# EAGLE design RTC_Card (EAGLE 7.6.0)

## Sheet 1 of 2
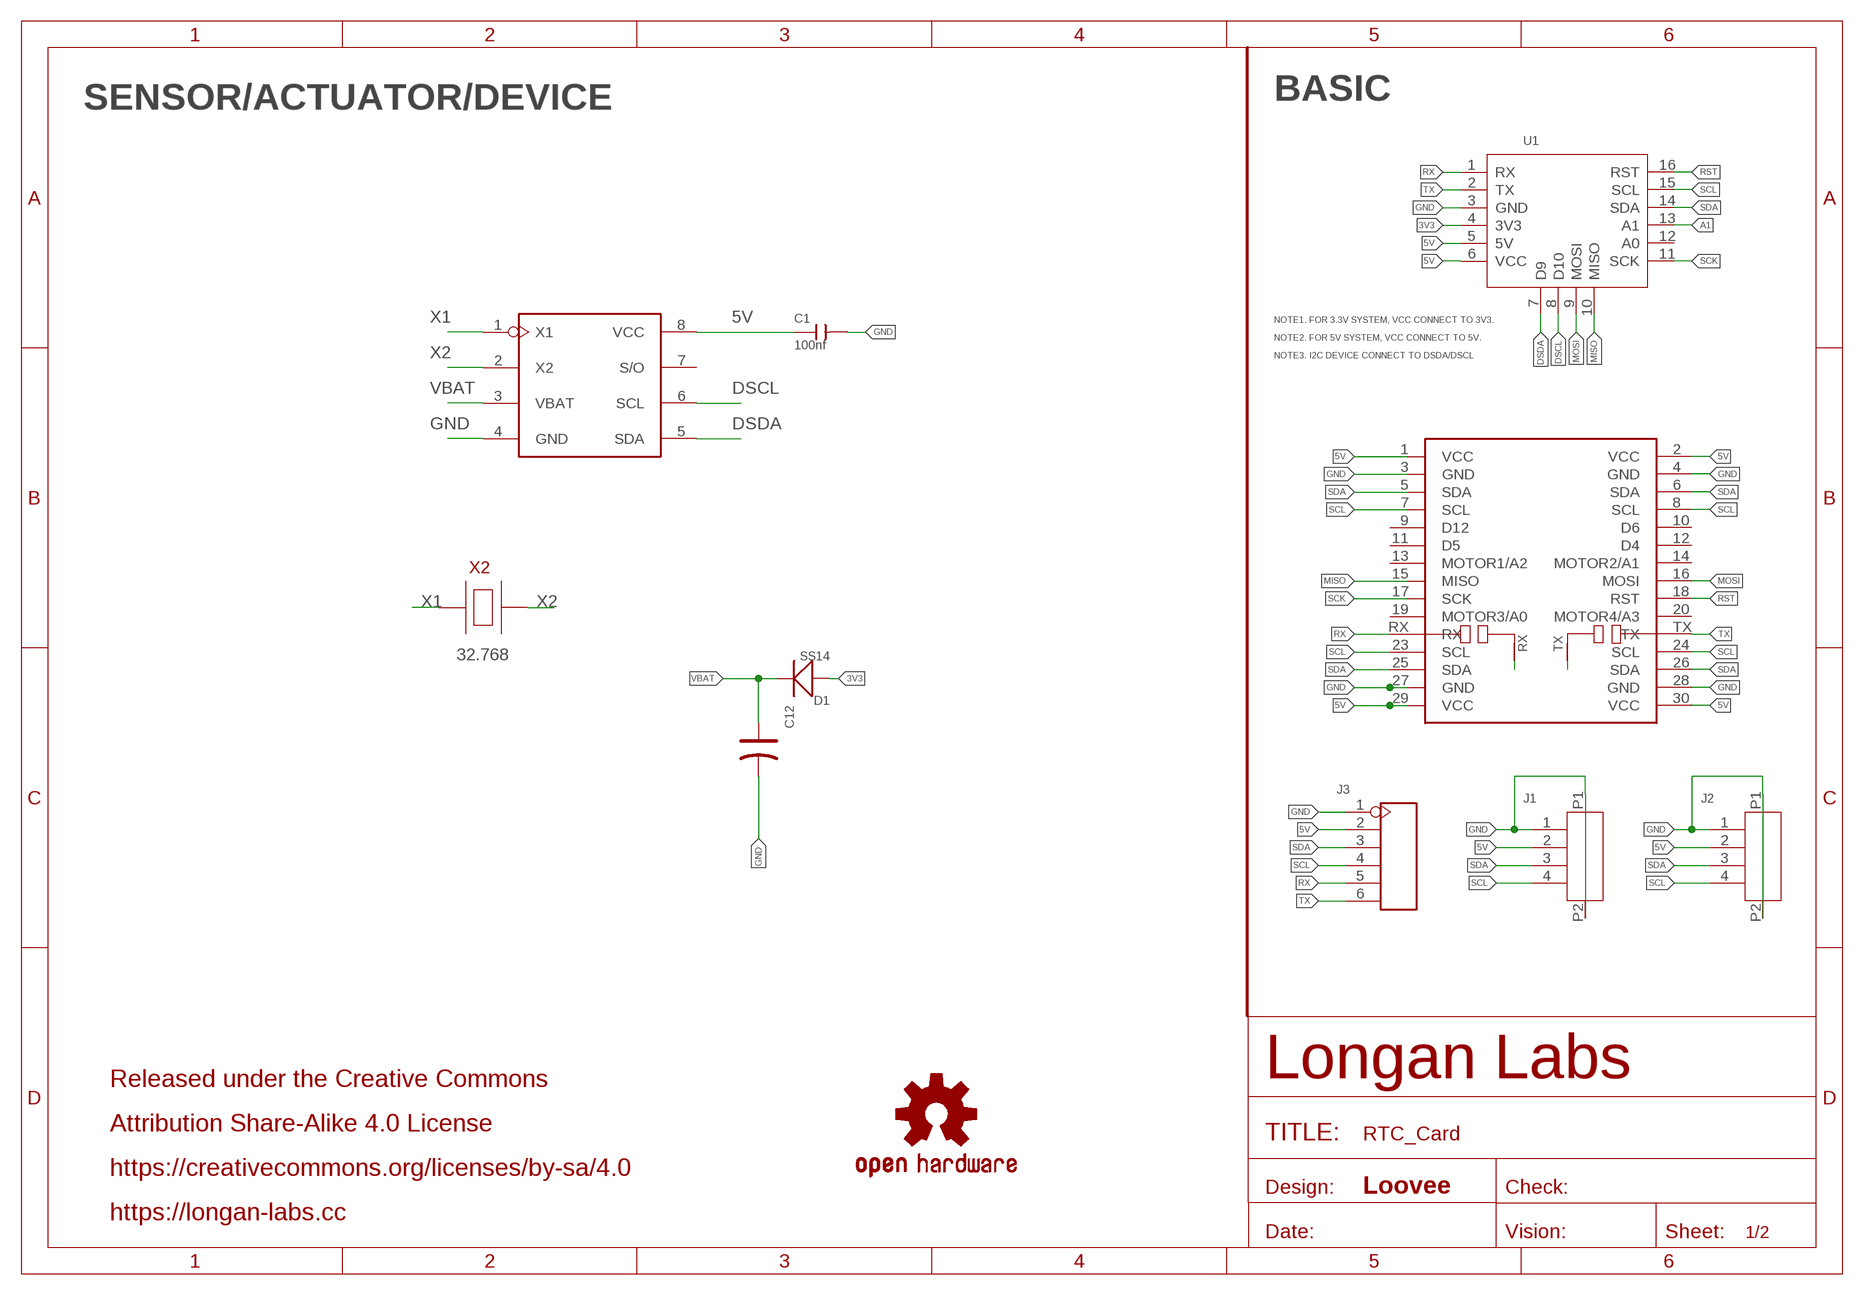
[diagram p0: schematic, sheet 1]

### Parts
C1  100nf  CAP-0603  [C0603]
C12  CAP-POLAR-CS-ME-414TA  [SC-2P-D4.8MM]
D1  SS14  DIODE'SMA'  [DO-214AC]
J1  HEADER-4P-1.0  [4P-1.0-90D]
J2  HEADER-4P-1.0  [4P-1.0-90D]
J3  HEADER-6P-55/35MIL  [H6-2.54]
LOGO2  OSHW-LOGOS  [OSHW-LOGO-S]
MOUDLE2  MOUDLE-CARDS-UART'BOARD'  [MOUDLE-2X15P-UART]
U1  MOUDLE-CARDS  [16P-2.0-CARDS]
U2  DS1307  [SO08]
X2  32768  CRYSTAL-2P  [2P-3215]

### Nets
3V3: D1.1(+) U1.4(3V3)
5V: C1.1 J1.2 J2.2 J3.2 MOUDLE2.1(VCC) MOUDLE2.2(VCC) MOUDLE2.29(VCC) MOUDLE2.30(VCC) U1.5(5V) U1.6(VCC) U2.8(VCC)
A1: U1.13(A1)
DSCL: U1.8(D10) U2.6(SCL)
DSDA: U1.7(D9) U2.5(SDA)
GND: C1.2 C12.2(-) J1.1 J1.P1 J1.P2 J2.1 J2.P1 J2.P2 J3.1 MOUDLE2.3(GND) MOUDLE2.4(GND) MOUDLE2.27(GND) MOUDLE2.28(GND) U1.3(GND) U2.4(GND)
MISO: MOUDLE2.15(MISO) U1.10(MISO)
MOSI: MOUDLE2.16(MOSI) U1.9(MOSI)
N$1: MOUDLE2.RX/N1(RX/N) MOUDLE2.RX/N2(RX/N)
N$2: MOUDLE2.TX/N1(TX/N) MOUDLE2.TX/N2(TX/N)
RST: MOUDLE2.18(RST) U1.16(RST)
RX: J3.5 MOUDLE2.RX U1.1(RX)
SCK: MOUDLE2.17(SCK) U1.11(SCK)
SCL: J1.4 J2.4 J3.4 MOUDLE2.7(SCL) MOUDLE2.8(SCL) MOUDLE2.23(SCL) MOUDLE2.24(SCL) U1.15(SCL)
SDA: J1.3 J2.3 J3.3 MOUDLE2.5(SDA) MOUDLE2.6(SDA) MOUDLE2.25(SDA) MOUDLE2.26(SDA) U1.14(SDA)
TX: J3.6 MOUDLE2.TX U1.2(TX)
VBAT: C12.1(+) D1.2(-) U2.3(VBAT)
X1: U2.1(X1) X2.X1
X2: U2.2(X2) X2.X2
Unconnected: MOUDLE2.9(D12) MOUDLE2.10(D6) MOUDLE2.11(D5) MOUDLE2.12(D4) MOUDLE2.13(MOTOR1/A2) MOUDLE2.14(MOTOR2/A1) MOUDLE2.19(MOTOR3/A0) MOUDLE2.20(MOTOR4/A3) U1.12(A0) U2.7(S/O)

### Notes on the sheet
- SENSOR/ACTUATOR/DEVICE | BASIC
- NOTE1. FOR 3.3V SYSTEM, VCC CONNECT TO 3V3.
- NOTE2. FOR 5V SYSTEM, VCC CONNECT TO 5V.
- NOTE3. I2C DEVICE CONNECT TO DSDA/DSCL
- 32.768
- Released under the Creative Commons
- Attribution Share-Alike 4.0 License
- https://creativecommons.org/licenses/by-sa/4.0
- Loovee
- https://longan-labs.cc

## Sheet 2 of 2

## Library data of the parts
C1 = Discrete-new:CAP: Ceramic Capacitors
C12 = Discrete-new:CAP-POLAR: Electrolytic Capacitors,Tantalum Capacitors and Super Capacitors
D1 = Discrete-new:DIODE*
J1 J2 = Longan-Connect:HEADER-4P-1.0
J3 = Connector-new:HEADER-6P
LOGO2 = SparkFun-Aesthetics:OSHW-LOGO: Open-Source Hardware (OSHW) Logo This logo indicates the piece of hardware it is found on incorporates a OSHW license and/or adheres to the definition of open source hardware found here: http://freedomdefined.org/OSHW
MOUDLE2 = Longan-moudle:MOUDLE-CARDS-UART
U1 = MOUDLE-CARDS:MOUDLE-CARDS
U2 = Seeed:DS1307
X2 = LONGAN-DISCRETE:CRYSTAL-2P

## Net classes
0 default: width 0.152 mm, clearance 0.152 mm

## Board
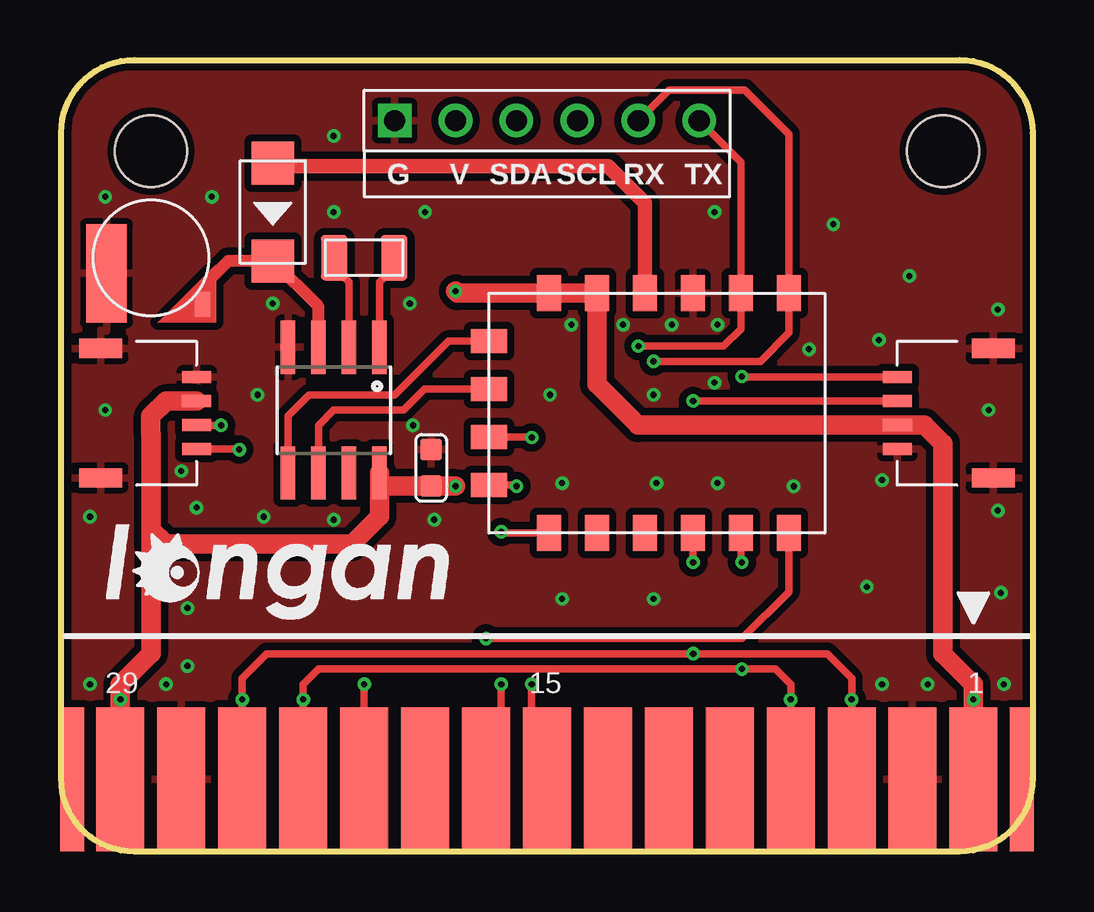
[diagram p1: board, top side]
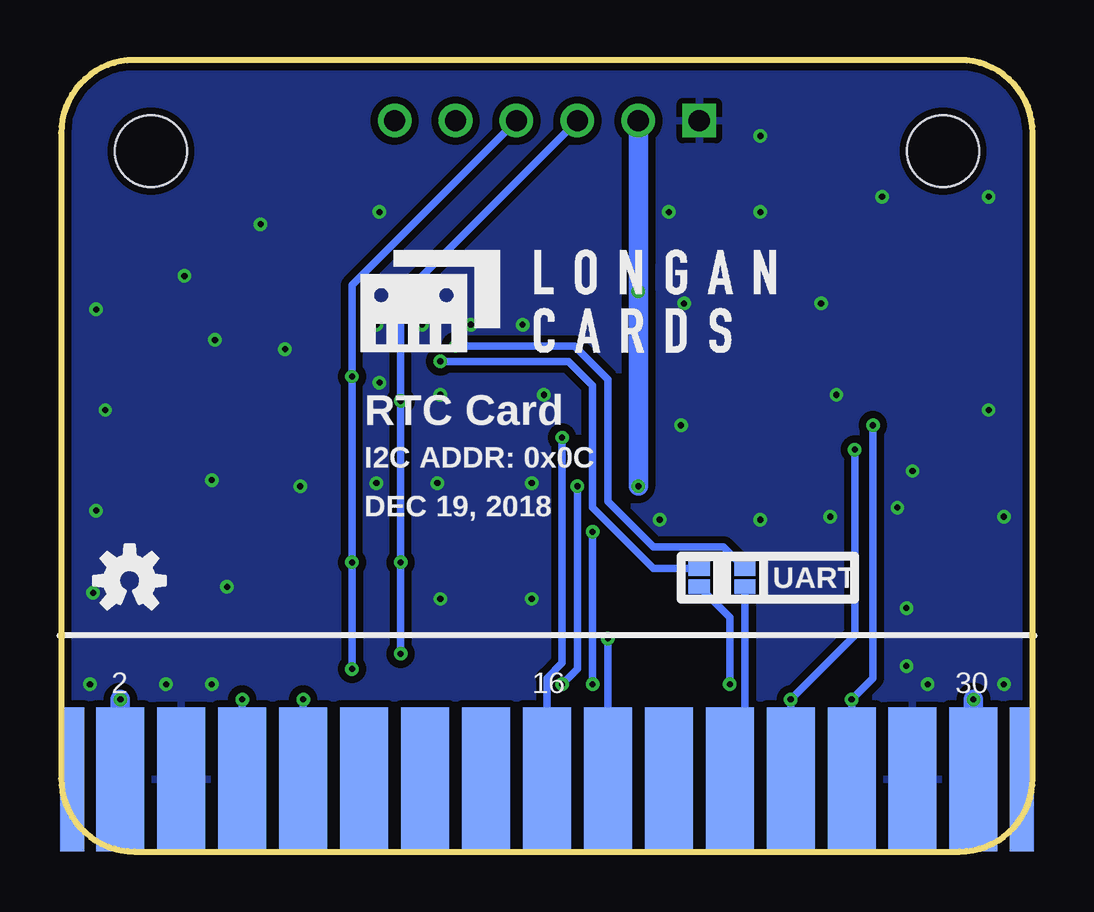
[diagram p2: board, bottom side, seen from below]

Size 40.5 x 33 mm. Coordinates in mm from the lower left corner, seen from the top.
Copper layers (1*16): Top 0.035mm / dielectric 1.5mm / Bottom 0.035mm
Design rules "SeeedStudio_2layer_DRU_no_angle_20140221 *": minimum track width 6mil, minimum drill 10mil, track to track 6mil, track to pad 6mil, pad to pad 6mil, via to via 6mil, smd to smd 0mil, copper to edge 10mil, drill to drill 10mil, minimum pad ring 10mil, minimum via ring 6mil, stop-mask expansion 2mil, vias tented up to drill 25mil, thermal gap 10mil

### Footprints (pad centres in the part's own frame; a part is rotated, then mirrored left to right if it is on the bottom)
C0603 = smd 0.889 x 0.889: 1 0,0.762; 2 0,-0.762
SC-2P-D4.8MM = smd 1.016 x 0.635: 1 1.943,2.154 | smd 4.1 x 1.7: 2 0.65,-1.85
DO-214AC = smd 1.8 x 1.77: 1 -2.042,0; 2 2.042,0
4P-1.0-90D = smd 1.2 x 0.5: 1 0,1.5; 2 0,0.5; 3 0,-0.5; 4 0,-1.5 | smd 1.8 x 0.8: P1 -4,2.7; P2 -4,-2.7
H6-2.54 = drill 0.889 pad 1.397 square: 1 0,6.35 | drill 0.889 pad 1.397: 2 0,3.81; 3 0,1.27; 4 0,-1.27; 5 0,-3.81; 6 0,-6.35
MOUDLE-2X15P-UART = smd 2 x 6: 1 17.78,-13.492; 3 15.24,-13.492; 5 12.7,-13.492; 7 10.16,-13.492; 9 7.62,-13.492; 11 5.08,-13.492; 13 2.54,-13.492; 15 0,-13.492; 17 -2.54,-13.492; 19 -5.08,-13.492; 23 -10.16,-13.492; 25 -12.7,-13.492; 27 -15.24,-13.492; 29 -17.78,-13.492; RX/N2 -7.62,-13.492 | smd 2 x 6 bottom: 2 17.78,-13.492; 4 15.24,-13.492; 6 12.7,-13.492; 8 10.16,-13.492; 10 7.62,-13.492; 12 5.08,-13.492; 14 2.54,-13.492; 16 0,-13.492; 18 -2.54,-13.492; 20 -5.08,-13.492; 24 -10.16,-13.492; 26 -12.7,-13.492; 28 -15.24,-13.492; 30 -17.78,-13.492; TX/N2 -7.62,-13.492 | smd 1 x 6: P1 -19.8,-13.492; P4 19.8,-13.492 | smd 1 x 6 bottom: P2 -19.8,-13.492; P3 19.8,-13.492 | smd 0.889 x 0.61 bottom: RX -6.35,-4.699; RX/N1 -6.35,-5.461; TX -8.255,-4.699; TX/N1 -8.255,-5.461 | hole 3: -16.51,12.7; 16.51,12.7
16P-2.0-CARDS = smd 1.5 x 1: 1 -5,5; 2 -5,3; 3 -5,1; 4 -5,-1; 5 -5,-3; 6 -5,-5; 11 5,-5; 12 5,-3; 13 5,-1; 14 5,1; 15 5,3; 16 5,5 | smd 1 x 1.5: 7 -3,-7.5; 8 -1,-7.5; 9 1,-7.5; 10 3,-7.5
SO08 = smd 0.61 x 2.21: 1 -1.905,-2.616; 2 -0.635,-2.616; 3 0.635,-2.616; 4 1.905,-2.616; 5 1.905,2.616; 6 0.635,2.616; 7 -0.635,2.616; 8 -1.905,2.616
2P-3215 = smd 1.1 x 1.9: X1 -1.25,0; X2 1.25,0

### Placement (x,y rotation side)
C1  15.42,15.99 180 top
C12  3.74,24.76 270 top
D1  8.82,26.66 270 top
J1  5.64,18.28 0 top
J2  34.86,18.28 180 top
J3  20.25,30.47 90 top
LOGO2  37.65,11.29 0 bottom
MOUDLE2  20.25,16.5 0 top
U1  25.33,18.28 270 top
U2  11.36,18.41 180 top
U$1  [LONGAN-CARDS-MIDDLE]  28.76,20.31 0 bottom
U$2  [LONGAN-SILK-SMALLER]  0.57,8.5 0 top
X2  12.63,24.76 180 top

### Tracks (layer width: path | path; a pad name or v marks a point on that pad's centre or on a via)
3V3
  Top 0.61: U1.4 24.33,27.02 22.79,28.56 8.96,28.56 D1.1
5V  (via drill 0.25 pad 0.51)
  Top 0.152: U1.6 20.33,23.95
  Top 0.508: U1.5 22.33,23.15 | 38.03,6.47 v38.03,6.34
  Top 0.61: 4.5,12.82 3.75,12.82 | 4.5,12.82 3.74,13.58 | 4.5,12.82 3.87,12.18
  Top 0.813: 22.41,23.23 22.33,23.15 22.33,19.5 24.05,17.78 J2.2 35.99,17.78 36.76,17.01 36.76,8.24 38.03,6.97 38.03,6.47 MOUDLE2.2 | 4.5,12.82 12.12,12.82 13.27,13.96 13.27,15.23 | 13.27,15.23 U2.8 | 13.27,15.23 C1.1 v16.44,15.23 | MOUDLE2.30 v2.47,6.34 2.47,6.97 3.75,8.25 3.75,12.82 3.75,17.38 3.74,17.39 3.74,18.15 4.37,18.78 J1.2 | U1.5 20.93,23.28 U1.6 16.52,23.28 v16.44,23.36
  Bottom 0.813: v2.47,6.34 MOUDLE2.30 | v38.03,6.34 MOUDLE2.2 | J3.2 16.44,24.5 v16.44,23.36 v16.44,15.23
DSCL
  Top 0.305: U2.6 10.72,17.77 11.36,18.41 14.28,18.41 15.15,19.28 U1.8
DSDA
  Top 0.305: U2.5 9.46,18.15 10.34,19.04 13.9,19.04 16.14,21.28 U1.7
GND  (via drill 0.25 pad 0.51)
  other vias: 34.22,6.97 36.12,6.97 39.3,6.97 4.38,6.97 5.26,7.74 1.2,6.97 1.84,18.41 5.01,15.87 1.2,13.96 21.27,21.96 25.46,21.96 27.36,21.96 23.43,21.96 24.7,19.04 27.23,19.55 20.38,19.04 20.89,15.36 24.82,15.36 27.36,15.36 30.54,15.23 38.66,18.41 39.05,22.6 39.05,14.21 34.22,15.48 34.09,21.33 27.23,26.66 31.17,20.95 32.19,26.15 35.36,23.99 33.59,11.04 39.17,10.79 8.19,19.04 14.66,17.77 5.64,14.34 5.26,10.15 20.89,10.53 24.7,10.53 8.44,13.96 11.36,13.83 15.55,13.83 14.54,22.85 8.82,22.85 1.84,27.3 6.28,27.3 11.36,29.84 15.17,26.66 11.36,26.66
  pour Top (isolate 0.305): -0.07,33.01 40.57,33.01 40.57,-0.01 -0.07,-0.01
  pour Bottom (isolate 0.305): -0.07,33.01 40.57,33.01 40.57,-0.01 -0.07,-0.01
MISO  (via drill 0.25 pad 0.51)
  Top 0.305: U1.10 18.93,15.28 v18.98,15.23 | v19.61,6.97 19.61,3.64 MOUDLE2.15
  Bottom 0.305: v18.98,15.23 18.98,7.61 v19.61,6.97
MOSI  (via drill 0.25 pad 0.51)
  Top 0.305: U1.9 19.6,17.28 v19.61,17.26
  Bottom 0.305: v19.61,17.26 19.61,7.86 20.25,7.23 MOUDLE2.16
N$1  (via drill 0.25 pad 0.51)
  Top 0.305: MOUDLE2.RX/N2 v12.63,6.97
  Bottom 0.305: v12.63,6.97 12.63,9.77 MOUDLE2.RX/N1
N$2
  Bottom 0.305: MOUDLE2.TX/N1 11.99,3.64 MOUDLE2.TX/N2
RST  (via drill 0.25 pad 0.51)
  Top 0.305: U1.16 30.33,10.83 28.38,8.88 v17.71,8.88
  Bottom 0.305: v17.71,8.88 MOUDLE2.18
RX  (via drill 0.25 pad 0.51)
  Top 0.305: J3.5 25.33,31.74 28.51,31.74 30.33,29.91 U1.1 30.33,21.63 29.14,20.44 v24.7,20.44
  Bottom 0.305: v24.7,20.44 19.36,20.44 18.34,19.42 18.34,14.34 15.8,11.8 MOUDLE2.RX
SCK  (via drill 0.25 pad 0.51)
  Top 0.305: U1.11 18.39,13.28 v18.34,13.32 | v18.34,6.97 18.34,3.64 18.32,3.64 17.33,2.66 17.36,2.66 MOUDLE2.17
  Bottom 0.305: v18.34,13.32 v18.34,6.97
SCL  (via drill 0.25 pad 0.51)
  Top 0.305: U1.15 28.33,12.1 v28.38,12.05 | J2.4 28.4,19.78 v28.38,19.8 | J1.4 7.4,16.78 v7.42,16.75 | MOUDLE2.8 v30.41,6.34 30.41,6.97 29.77,7.61 v28.38,7.61 10.72,7.61 10.09,6.97 10.09,6.72 v10.09,6.34 MOUDLE2.23
  Bottom 0.305: J3.4 28.38,23.61 v28.38,19.8 v28.38,12.05 v28.38,7.61 | v7.42,16.75 7.42,9.01 v10.09,6.34 MOUDLE2.23 | v30.41,6.34 MOUDLE2.8
SDA  (via drill 0.25 pad 0.51)
  Top 0.305: U1.14 26.33,12.07 v26.35,12.05 | J2.3 26.35,18.78 v26.35,18.79 | v6.66,17.77 5.65,17.77 J1.3 | MOUDLE2.6 v32.95,6.34 32.95,7.23 31.93,8.24 v26.35,8.24 8.57,8.24 7.55,7.23 7.55,6.97 v7.55,6.34 MOUDLE2.25
  Bottom 0.305: J3.3 26.35,23.1 v26.35,18.79 v26.35,12.05 v26.35,8.24 | v6.66,17.77 6.66,7.23 v7.55,6.34 MOUDLE2.25 | v32.95,6.34 MOUDLE2.6
TX  (via drill 0.25 pad 0.51)
  Top 0.305: J3.6 28.33,28.74 U1.2 28.33,21.79 27.62,21.07 v24.06,21.07
  Bottom 0.305: v24.06,21.07 19.11,21.07 17.71,19.68 17.71,14.6 15.8,12.69 12.88,12.69 MOUDLE2.TX
VBAT
  Top 0.508: U2.3 10.72,22.71 D1.2 6.97,24.62 5.89,23.54 C12.1
X1
  Top 0.305: U2.1 13.27,23.74 13.65,24.12 13.65,24.52 X2.X1
X2
  Top 0.305: U2.2 11.99,23.74 11.74,23.99 11.74,24.39 X2.X2

### Text on the board
tPlace: G | V | SDA | SCL | RX | TX
bPlace: RTC Card | I2C ADDR: 0x0C | DEC 19, 2018